# Altium schematic sheet 555.SchDoc: 555 Timer Tutorial
size Letter; DrawnBy: Aidan Gratton; SheetNumber: 1; SheetTotal: 1
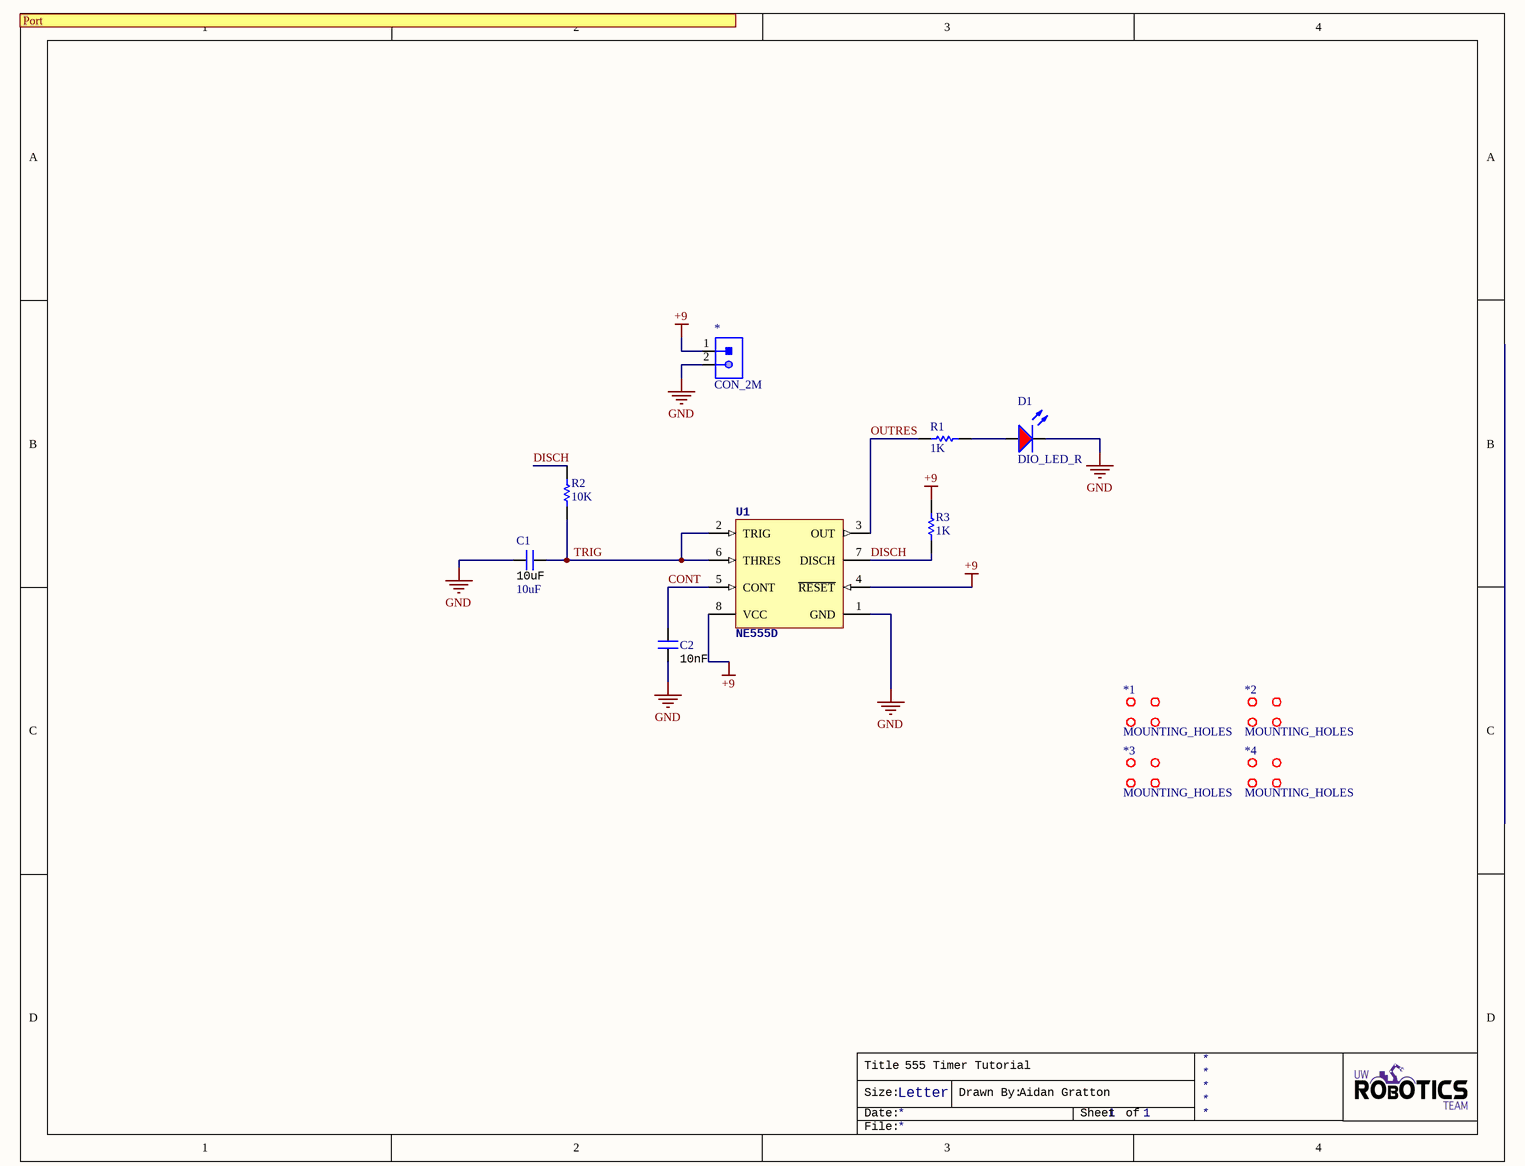
[diagram p0: 555.SchDoc]

## Parts
*  CON_2M  [JST-B2B-PHSK]
*1  MOUNTING_HOLES  [MOUNTING_HOLE]
*2  MOUNTING_HOLES  [MOUNTING_HOLE]
*3  MOUNTING_HOLES  [MOUNTING_HOLE]
*4  MOUNTING_HOLES  [MOUNTING_HOLE]
C1  10uF  [CAPC0603(1608)55_N]
C2  value 10nF  [CAPC0603(1608)55_N]  (hidden comment: CAP_10nF_0603)
D1  DIO_LED_R  [LED_0805_LINE]
R1  value 1K  [RESC0603(1608)_N]  (hidden comment: RES_1K_0603)
R2  value 10K  [RESC0603(1608)_N]  (hidden comment: RES_10K_0603)
R3  value 1K  [RESC0603(1608)_N]  (hidden comment: RES_1K_0603)
U1  NE555D  [8-SOIC_M]

## Ports
Port

## Nets
+9: *.1 R3.2 U1.4(~{RESET}) U1.8(VCC)
GND: *.2 C1.1 C2.1 D1.2(K) U1.1(GND)
CONT: C2.2 U1.5(CONT)
DISCH: R2.2 R3.1 U1.7(DISCH)
OUTRES: R1.1 U1.3(OUT)
TRIG: C1.2 R2.1 U1.2(TRIG) U1.6(THRES)
NetD1_1: D1.1(A) R1.2

## Notes on the sheet
- Title
- Size:
- Date:
- Letter
- Drawn By:
- Sheet
- of
- File:

## Library data of the parts
*1-*4 = MOUNTING_HOLES: 6cm x 6cm
C1 = CAP_10uF_0603: CAP CER 10UF 10V X5R 0603; MPN: CC0603MRX5R6BB106; Manufacturer: Yageo; Dimensions: 0.063" L x 0.031" W (1.60mm x 0.80mm); Package: 0603 (1608 Metric); Voltage Rating: 10V; Digikey Part Number: 311-1817-1-ND; Value: 10uF
C2 = CAP_10nF_0603: CAP CER 10000PF 16V X7R 0603; MPN: CC0603KRX7R7BB103; Manufacturer: Yageo; Dimensions: 0.063" L x 0.031" W (1.60mm x 0.80mm); Package: 0603 (1608 Metric); Temperature Coefficient: X7R; Voltage Rating: 16V; Digikey Part Number: 311-3369-1-ND
D1 = DIO_LED_R: LED RED DIFFUSED 0805 SMD; MPN: LS R976-NR-1; Manufacturer: OSRAM; Forward Voltage Drop: 2V; Package: 0805 (2012 Metric); Digikey Part Number: 475-1278-1-ND
R1 R3 = RES_1K_0603: RES SMD 1K OHM 5% 1/10W 0603; Manufacturer: Yageo; MPN: RC0603JR-071KL; Dimensions: 0.063" L x 0.031" W (1.60mm x 0.80mm); Tolerance: 5%; Package: 0603 (1608 Metric); Digikey Part Number: 311-1.0KGRCT-ND
R2 = RES_10K_0603: RES SMD 10K OHM 5% 1/10W 0603; Manufacturer: Yageo; MPN: RC0603JR-0710KL; Package: 0603 (1608 Metric); Dimensions: 0.063" L x 0.031" W (1.60mm x 0.80mm); Tolerance: 5%; Digikey Part Number: 311-10KGRCT-ND
U1 = NE555D: Precision Timer, 4.5 to 16 V, 0 to 70 degC, 8-Pin SOIC (D), Green (RoHS & no Sb/Br), Tube; PartNumber: NE555; Manufacturer: Texas Instruments; Base Number: 555; No. of Timers: 1; Supply Voltage Min: 4.5V; Operating Frequency Max: 0.5MHz; Supply Voltage Range: 4.5Vto16V; No. of Pins: 8; Supply Voltage Max: 16V; IC Temperature Range: Commercial; SVHC: NoSVHC(19-Dec-2012); Operating Mode: Astable,Monostable; Frequency: 500kHz; Package Description: 8-Pin Small Outline Integrated Circuit, Body 4.9 x 3.9 mm, Pitch 1.27 mm; Datasheet URL: http://www.ti.com/general/docs/lit/getliterature.tsp?genericPartNumber=NE555&fileType=pdf; Mounting Technology: SurfaceMount; Operating Temperature Range: 0°Cto+70°C; Operating Temperature Min: 0°C; Package URL: http://www.ti.com/lit/ml/msoi002j/msoi002j.pdf; Datasheet Version: Rev. I, 09/2014; Manufacturer URL: http://www.ti.com/; Digital IC Case Style: SOIC; Clock External Input: No; Logic Function Number: 555; IC Generic Number: 555; No. of Channels: 1; Operating Temperature Max: 70°C; Package / Case: SOIC; Package Reference: D8; Device Marking: NE555D